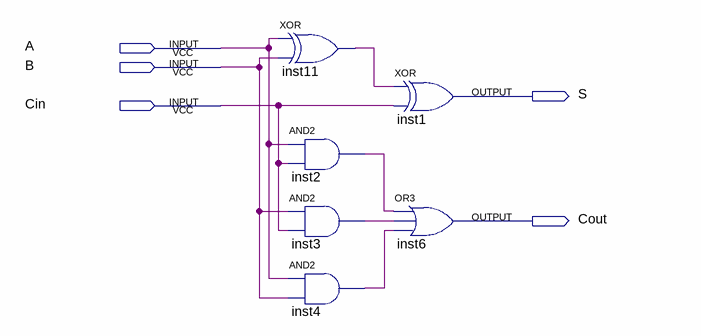
[diagram p0: schematic sheet]
// Quartus schematic FullAdder.bdf as structural Verilog: 6 symbols, 5 pins
module FullAdder (
  input  A,
  input  B,
  input  Cin,
  output S,
  output Cout
);

  wire inst2_out, inst3_out, inst4_out, inst11_out;

  xor inst11 (inst11_out, A, B);
  and inst2 (inst2_out, A, Cin);
  and inst3 (inst3_out, B, Cin);
  and inst4 (inst4_out, A, B);
  xor inst1 (S, inst11_out, Cin);
  or inst6 (Cout, inst2_out, inst3_out, inst4_out);
endmodule
